# Altium schematic sheet New_Action_Moteurs.SchDoc
size A4
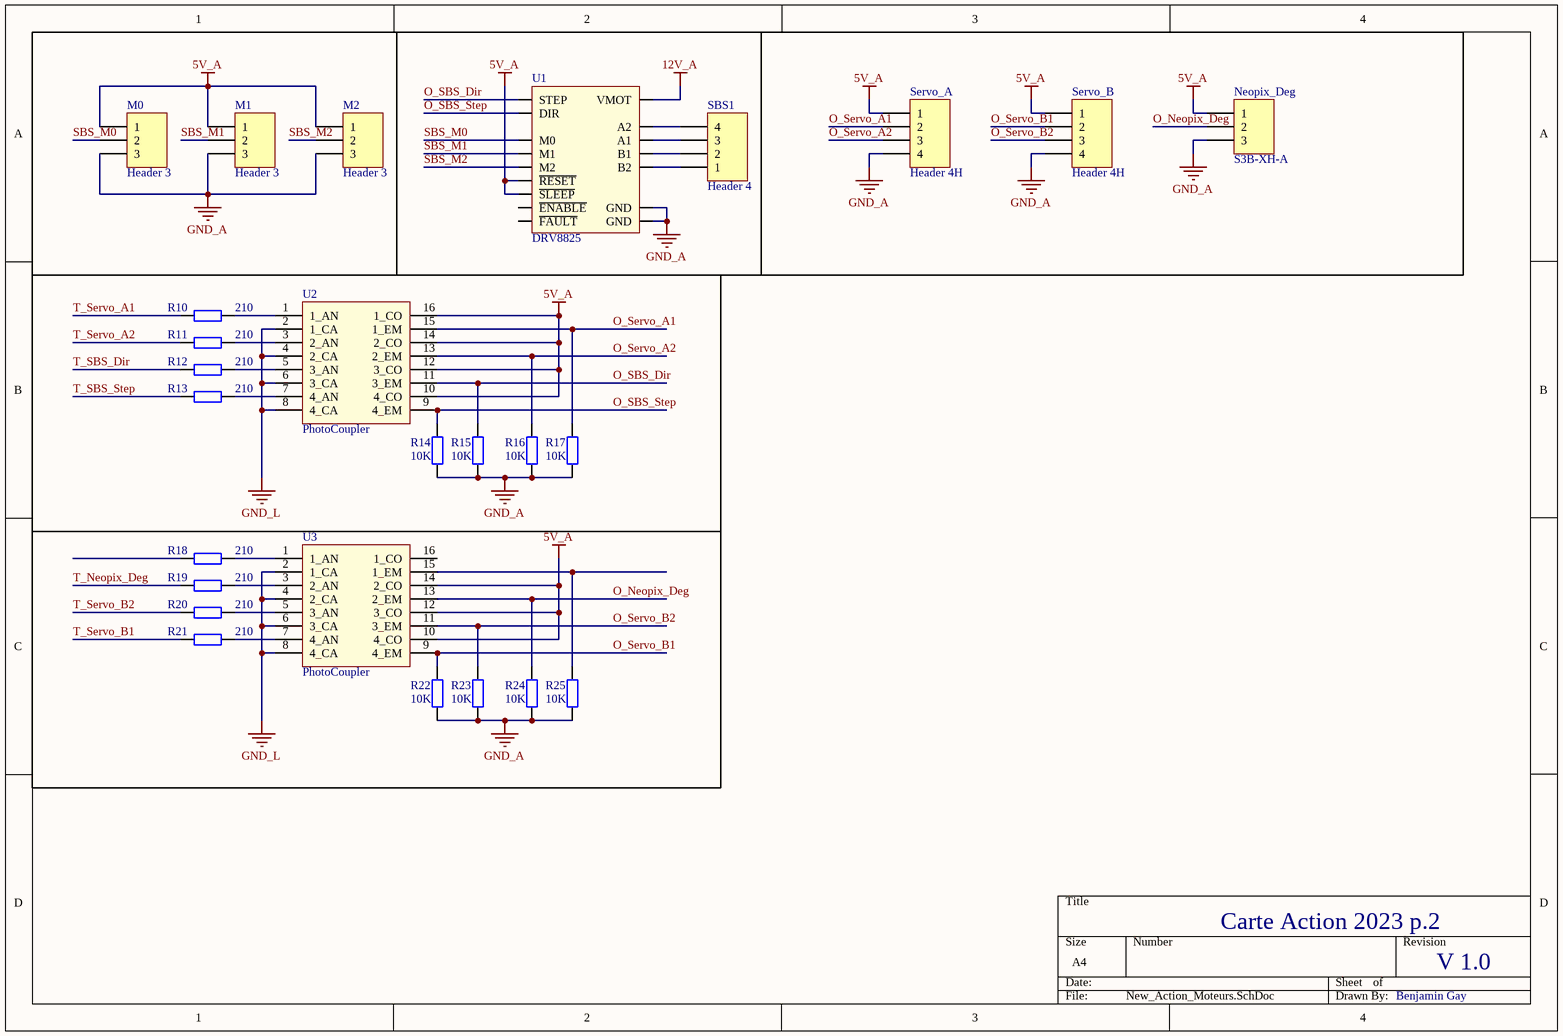
[diagram p0: New_Action_Moteurs.SchDoc]

## Parts
M0  Header 3  [HDR1X3]
M1  Header 3  [HDR1X3]
M2  Header 3  [HDR1X3]
Neopix_Deg  S3B-XH-A  [S3B-XH-A]
R10  value 210  [Resistor 1206]  (hidden comment: Res2)
R11  value 210  [Resistor 1206]  (hidden comment: Res2)
R12  value 210  [Resistor 1206]  (hidden comment: Res2)
R13  value 210  [Resistor 1206]  (hidden comment: Res2)
R14  value 10K  [Resistor 1206]  (hidden comment: Res2)
R15  value 10K  [Resistor 1206]  (hidden comment: Res2)
R16  value 10K  [Resistor 1206]  (hidden comment: Res2)
R17  value 10K  [Resistor 1206]  (hidden comment: Res2)
R18  value 210  [Resistor 1206]  (hidden comment: Res2)
R19  value 210  [Resistor 1206]  (hidden comment: Res2)
R20  value 210  [Resistor 1206]  (hidden comment: Res2)
R21  value 210  [Resistor 1206]  (hidden comment: Res2)
R22  value 10K  [Resistor 1206]  (hidden comment: Res2)
R23  value 10K  [Resistor 1206]  (hidden comment: Res2)
R24  value 10K  [Resistor 1206]  (hidden comment: Res2)
R25  value 10K  [Resistor 1206]  (hidden comment: Res2)
SBS1  Header 4  [S4B-XH-A]
Servo_A  Header 4H  [S4B-XH-A]
Servo_B  Header 4H  [S4B-XH-A]
U1  DRV8825  [DRV8825]
U2  PhotoCoupler  [16 pins SOIC, TI]
U3  PhotoCoupler  [16 pins SOIC, TI]

## Nets
5V_A: M0.1 M1.1 M2.1 Neopix_Deg.1 Servo_A.1 Servo_B.1 U1.5(~{RESET}) U1.6(~{SLEEP}) U2.10(4_CO) U2.12(3_CO) U2.14(2_CO) U2.16(1_CO) U3.10(4_CO) U3.12(3_CO) U3.14(2_CO)
12V_A: U1.16(VMOT)
GND_A: M0.3 M1.3 M2.3 Neopix_Deg.3 R14.1 R15.1 R16.1 R17.1 R22.1 R23.1 R24.1 R25.1 Servo_A.4 Servo_B.4 U1.9(GND) U1.15(GND)
GND_L: U2.2(1_CA) U2.4(2_CA) U2.6(3_CA) U2.8(4_CA) U3.2(1_CA) U3.4(2_CA) U3.6(3_CA) U3.8(4_CA)
O_Neopix_Deg: Neopix_Deg.2 R24.2 U3.13(2_EM)
O_SBS_Dir: R15.2 U1.7(STEP) U2.11(3_EM)
O_SBS_Step: R14.2 U1.8(DIR) U2.9(4_EM)
O_Servo_A1: R17.2 Servo_A.2 U2.15(1_EM)
O_Servo_A2: R16.2 Servo_A.3 U2.13(2_EM)
O_Servo_B1: R22.2 Servo_B.2 U3.9(4_EM)
O_Servo_B2: R23.2 Servo_B.3 U3.11(3_EM)
SBS_M0: M0.2 U1.2(M0)
SBS_M1: M1.2 U1.3(M1)
SBS_M2: M2.2 U1.4(M2)
T_Neopix_Deg: R19.2
T_SBS_Dir: R12.2
T_SBS_Step: R13.2
T_Servo_A1: R10.2
T_Servo_A2: R11.2
T_Servo_B1: R21.2
T_Servo_B2: R20.2
NetR10_1: R10.1 U2.1(1_AN)
NetR11_1: R11.1 U2.3(2_AN)
NetR12_1: R12.1 U2.5(3_AN)
NetR13_1: R13.1 U2.7(4_AN)
NetR18_1: R18.1 U3.1(1_AN)
NetR19_1: R19.1 U3.3(2_AN)
NetR20_1: R20.1 U3.5(3_AN)
NetR21_1: R21.1 U3.7(4_AN)
NetR25_2: R25.2 U3.15(1_EM)
NetSBS1_1: SBS1.1 U1.14(B2)
NetSBS1_2: SBS1.2 U1.13(B1)
NetSBS1_3: SBS1.3 U1.12(A1)
NetSBS1_4: SBS1.4 U1.11(A2)

Not connected (* = marked no-connect by the designer): R18 2; U1 1(~{ENABLE}) 10(~{FAULT}); U3 16(1_CO)

## Notes on the sheet
- Carte Action 2023 p.2
- V 1.0
- Benjamin Gay

## Library data of the parts
M0-M2 = Header 3: Header, 3-Pin; LatestRevisionDate: 17-Jul-2002; LatestRevisionNote: Re-released for DXP Platform.; Publisher: Altium Limited
Neopix_Deg = Header 3H: Header, 3-Pin, Right Angle; LatestRevisionDate: 17-Jul-2002; LatestRevisionNote: Re-released for DXP Platform.; Publisher: Altium Limited
R10-R25 = Res2: Resistor; Published: 8-Jun-2000; LatestRevisionDate: 17-Jul-2002; LatestRevisionNote: Re-released for DXP Platform.; PackageReference: AXIAL-0.4; Publisher: Altium Limited; PackageDescription: Axial Device, Thru-Hole; 2 Leads; 0.4 in Pin Spacing
SBS1 = Header 4: Header, 4-Pin; LatestRevisionDate: 17-Jul-2002; LatestRevisionNote: Re-released for DXP Platform.; Publisher: Altium Limited
Servo_A Servo_B = Header 4H: Header, 4-Pin, Right Angle; LatestRevisionDate: 17-Jul-2002; LatestRevisionNote: Re-released for DXP Platform.; Publisher: Altium Limited
U1 = DRV8825: Stepper Driver Module
U2 U3 = LTV-247: Integrated Circuit; Manufacturer_Name: Lite-On; Datasheet Link: http://optoelectronics.liteon.com/upload/download/DS70-2009-0014/LTV-2X7%20sereis%20Mar17.PDF; Manufacturer_Part_Number: LTV-247; Mouser Part Number: 859-LTV-247; Mouser Price/Stock: https://www.mouser.co.uk/ProductDetail/Lite-On/LTV-247/?qs=9ayhpukWNmvWpoxQBzWkFA%3D%3D; Arrow Part Number: LTV-247; Arrow Price/Stock: https://www.arrow.com/en/products/ltv-247/lite-on-technology